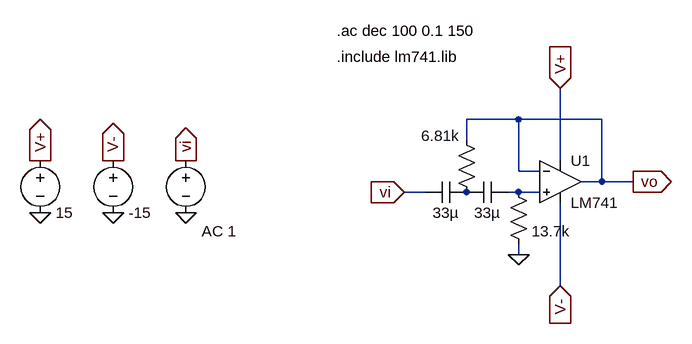
[diagram p0: schematic HPF_sim.asc]
HPF_sim.asc, the LTspice schematic file:
Version 4.1
SHEET 1 880 680
WIRE 208 96 128 96
WIRE 336 96 208 96
WIRE 128 128 128 96
WIRE 272 160 272 48
WIRE 208 176 208 96
WIRE 240 176 208 176
WIRE 336 192 336 96
WIRE 336 192 304 192
WIRE 384 192 336 192
WIRE 64 208 32 208
WIRE 208 208 192 208
WIRE 240 208 208 208
WIRE 208 304 208 288
WIRE 272 352 272 224
FLAG 208 304 0
FLAG 272 48 V+
IOPIN 272 48 In
FLAG 272 352 V-
IOPIN 272 352 In
FLAG 32 208 vi
IOPIN 32 208 In
FLAG 384 192 vo
IOPIN 384 192 Out
FLAG -528 240 0
FLAG -416 240 0
FLAG -304 240 0
FLAG -528 160 V+
IOPIN -528 160 Out
FLAG -416 160 V-
IOPIN -416 160 Out
FLAG -304 160 vi
IOPIN -304 160 Out
SYMBOL OpAmps\\opamp2 272 128 R0
SYMATTR InstName U1
SYMATTR Value LM741
SYMBOL cap 128 192 R90
WINDOW 0 0 32 Invisible 2
WINDOW 3 32 32 VTop 2
SYMATTR InstName C1
SYMATTR Value 33µ
SYMBOL cap 192 192 R90
WINDOW 0 0 32 Invisible 2
WINDOW 3 32 32 VTop 2
SYMATTR InstName C2
SYMATTR Value 33µ
SYMBOL res 192 192 R0
WINDOW 0 36 40 Invisible 2
SYMATTR InstName R1
SYMATTR Value 13.7k
SYMBOL res 112 112 R0
WINDOW 0 36 40 Invisible 2
WINDOW 3 -24 25 Bottom 2
SYMATTR InstName R2
SYMATTR Value 6.81k
SYMBOL voltage -528 144 R0
WINDOW 0 24 16 Invisible 2
WINDOW 123 0 0 Left 0
WINDOW 39 0 0 Left 0
SYMATTR InstName V1
SYMATTR Value 15
SYMBOL voltage -416 144 R0
WINDOW 0 24 16 Invisible 2
WINDOW 123 0 0 Left 0
WINDOW 39 0 0 Left 0
SYMATTR InstName V2
SYMATTR Value -15
SYMBOL voltage -304 144 R0
WINDOW 0 24 16 Invisible 2
WINDOW 123 24 124 Left 2
WINDOW 39 0 0 Left 0
SYMATTR InstName V3
SYMATTR Value2 AC 1
SYMATTR Value ""
TEXT -72 0 Left 2 !.include lm741.lib
TEXT -72 -40 Left 2 !.ac dec 100 0.1 150

The netlist it stands for:
* HPF_sim.asc
X§U1 N001 vo V+ V- vo LM741  ; pins In+ In- V+ V- OUT
C1 P001 vi 33µ
C2 N001 P001 33µ
R1 N001 0 13.7k
R2 vo P001 6.81k
V1 V+ 0 15
V2 V- 0 -15
V3 vi 0 AC 1
.include lm741.lib
.ac dec 100 0.1 150
.backanno
.end